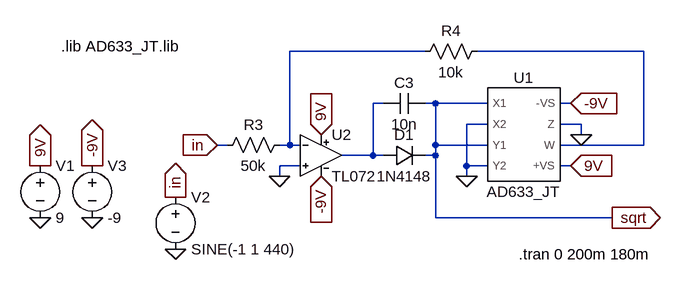
[diagram p0: schematic AD633-subgenerator.asc]
AD633-subgenerator.asc, the LTspice schematic file:
Version 4
SHEET 1 880 680
WIRE 368 112 160 112
WIRE 704 112 448 112
WIRE 304 192 288 192
WIRE 384 192 368 192
WIRE 464 192 384 192
WIRE 592 192 576 192
WIRE 464 224 432 224
WIRE 608 224 576 224
WIRE 608 240 608 224
WIRE 64 256 48 256
WIRE 160 256 160 112
WIRE 160 256 144 256
WIRE 176 256 160 256
WIRE 384 256 384 192
WIRE 464 256 384 256
WIRE 704 256 704 112
WIRE 704 256 576 256
WIRE 288 272 288 192
WIRE 288 272 240 272
WIRE 304 272 288 272
WIRE 384 272 384 256
WIRE 384 272 368 272
WIRE 176 288 144 288
WIRE 432 288 432 224
WIRE 464 288 432 288
WIRE 592 288 576 288
WIRE 144 304 144 288
WIRE 432 304 432 288
WIRE 384 368 384 272
WIRE 656 368 384 368
FLAG -224 368 0
FLAG -224 288 9V
IOPIN -224 288 Out
FLAG 208 240 9V
IOPIN 208 240 In
FLAG 592 288 9V
IOPIN 592 288 In
FLAG 656 368 sqrt
IOPIN 656 368 Out
FLAG 48 256 in
IOPIN 48 256 In
FLAG -16 416 0
FLAG -16 336 in
IOPIN -16 336 Out
FLAG -144 368 0
FLAG -144 288 -9V
IOPIN -144 288 Out
FLAG 208 304 -9V
IOPIN 208 304 In
FLAG 592 192 -9V
IOPIN 592 192 In
FLAG 144 304 0
FLAG 432 304 0
FLAG 608 240 0
SYMBOL AD633_JT 512 240 R0
SYMATTR InstName U1
SYMBOL TL072 208 208 R0
SYMATTR InstName U2
SYMBOL Voltage -224 272 R0
SYMATTR InstName V1
SYMATTR Value 9
SYMBOL Cap 368 176 R90
WINDOW 0 0 32 VBottom 2
WINDOW 3 32 32 VTop 2
SYMATTR InstName C3
SYMATTR Value 10n
SYMBOL diode 304 288 R270
WINDOW 0 32 32 VTop 2
WINDOW 3 0 32 VBottom 2
SYMATTR InstName D1
SYMATTR Value 1N4148
SYMBOL Res 160 240 R90
WINDOW 0 0 56 VBottom 2
WINDOW 3 32 56 VTop 2
SYMATTR InstName R3
SYMATTR Value 50k
SYMBOL Res 464 96 R90
WINDOW 0 0 56 VBottom 2
WINDOW 3 32 56 VTop 2
SYMATTR InstName R4
SYMATTR Value 10k
SYMBOL Voltage -16 320 R0
SYMATTR InstName V2
SYMATTR Value SINE(-1 1 440)
SYMBOL Voltage -144 272 R0
SYMATTR InstName V3
SYMATTR Value -9
TEXT 512 424 Left 2 !.tran 0 200m 180m
TEXT -192 104 Left 2 !.lib AD633_JT.lib

The netlist it stands for:
* AD633-subgenerator.asc
XU1 sqrt 0 sqrt 0 -9V 0 N002 9V AD633_JT  ; pins X1 X2 Y1 Y2 -VS Z W +VS
XU2 0 N001 9V -9V N003 TL072  ; pins In+ In- V+ V- OUT
V1 9V 0 9
C3 sqrt N003 10n
D1 N003 sqrt 1N4148
R3 N001 in 50k
R4 N002 N001 10k
V2 in 0 SINE(-1 1 440)
V3 -9V 0 -9
.model D D
.lib standard.dio
.tran 0 200m 180m
.lib AD633_JT.lib
.lib TL072.sub
.backanno
.end